# Altium schematic sheet Puerto VGA.SchDoc
size B
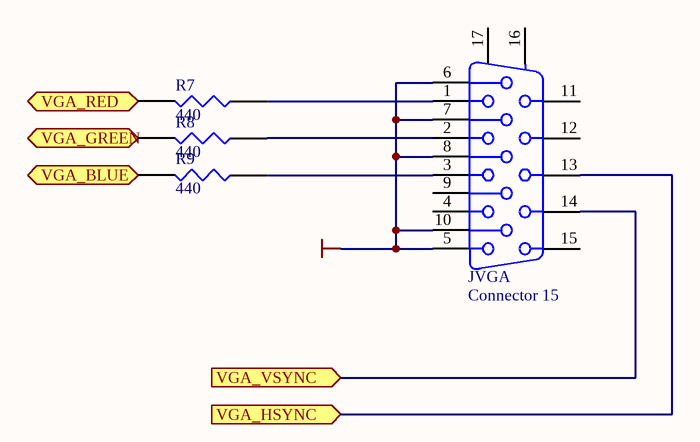
[diagram p0: Puerto VGA.SchDoc]

## Parts
JVGA  Connector 15  [VGACON]
R7  440  [AXIAL-0.4]
R8  440  [AXIAL-0.4]
R9  440  [AXIAL-0.4]

## Ports
VGA_BLUE (in), VGA_GREEN (in), VGA_HSYNC (in), VGA_RED (in), VGA_VSYNC (in)

## Nets
GND: JVGA.5 JVGA.6 JVGA.7 JVGA.8 JVGA.10
VGA_BLUE: R9.2 ; port VGA_BLUE
VGA_GREEN: R8.2 ; port VGA_GREEN
VGA_HSYNC: JVGA.13 ; port VGA_HSYNC
VGA_RED: R7.2 ; port VGA_RED
VGA_VSYNC: JVGA.14 ; port VGA_VSYNC
NetJVGA_1: JVGA.1 R7.1
NetJVGA_2: JVGA.2 R8.1
NetJVGA_3: JVGA.3 R9.1

Not connected (* = marked no-connect by the designer): JVGA 4 9 11 12 15 16(MH1) 17(MH2)

## Library data of the parts
JVGA = Connector 15: Receptacle Assembly, 15-Pin Connector; Manufacturer: Generic Components; Positions: 15; Gender: Receptacle Header; Published: 15/06/2001; Publisher: Altium Hobart Technology Centre; Class: Connector; Orientation: Right Angle
R7-R9 = RES1